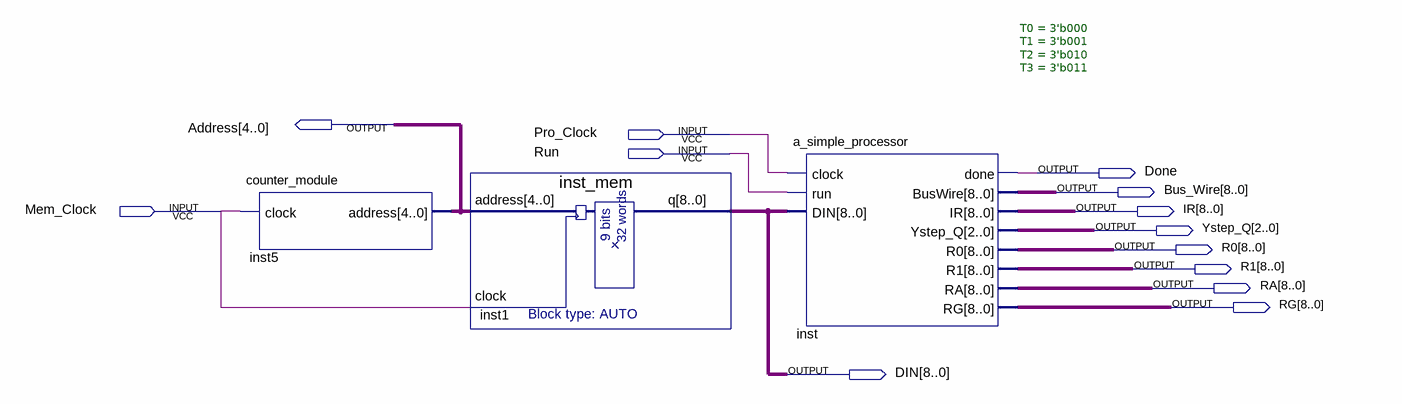
[diagram p0: schematic sheet]
// Quartus schematic A_simple_processor_with_ROM_or_something.bdf as structural Verilog: 3 symbols, 13 pins
module A_simple_processor_with_ROM_or_something (
  input  Pro_Clock,
  input  Run,
  input  Mem_Clock,
  output [4:0] Address,
  output Done,
  output [8:0] Bus_Wire,
  output [8:0] IR,
  output [2:0] Ystep_Q,
  output [8:0] R0,
  output [8:0] R1,
  output [8:0] RA,
  output [8:0] RG,
  output [8:0] DIN
);

  counter_module inst5 (.clock(Mem_Clock), .address(Address));
  inst_mem inst1 (.address(Address), .clock(Mem_Clock), .q(DIN));
  a_simple_processor #(.T0(3'b000), .T1(3'b001), .T2(3'b010), .T3(3'b011)) inst (
    .clock(Pro_Clock), .run(Run), .DIN(DIN), .done(Done), .BusWire(Bus_Wire), .IR(IR), .Ystep_Q(Ystep_Q),
    .R0(R0), .R1(R1), .RA(RA), .RG(RG));
endmodule
